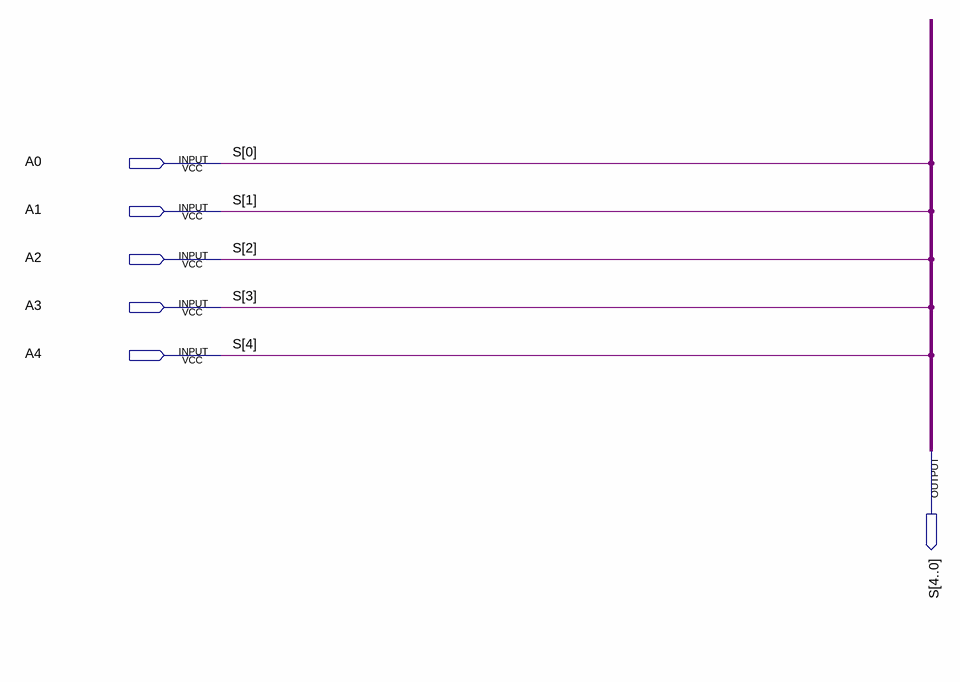
[diagram p0: schematic sheet]
// Quartus schematic juntar.bdf as structural Verilog: 0 symbols, 6 pins
module juntar (
  input  A0,
  input  A1,
  input  A2,
  input  A3,
  input  A4,
  output [4:0] S
);


  assign S = {A4, A3, A2, A1, A0};
endmodule
